# EAGLE design EBN_Storage_V01 (EAGLE 7.1.0)
CNAME: EasyBoard Nano; CREVISION: 1; DESIGNER: Martin Olejar
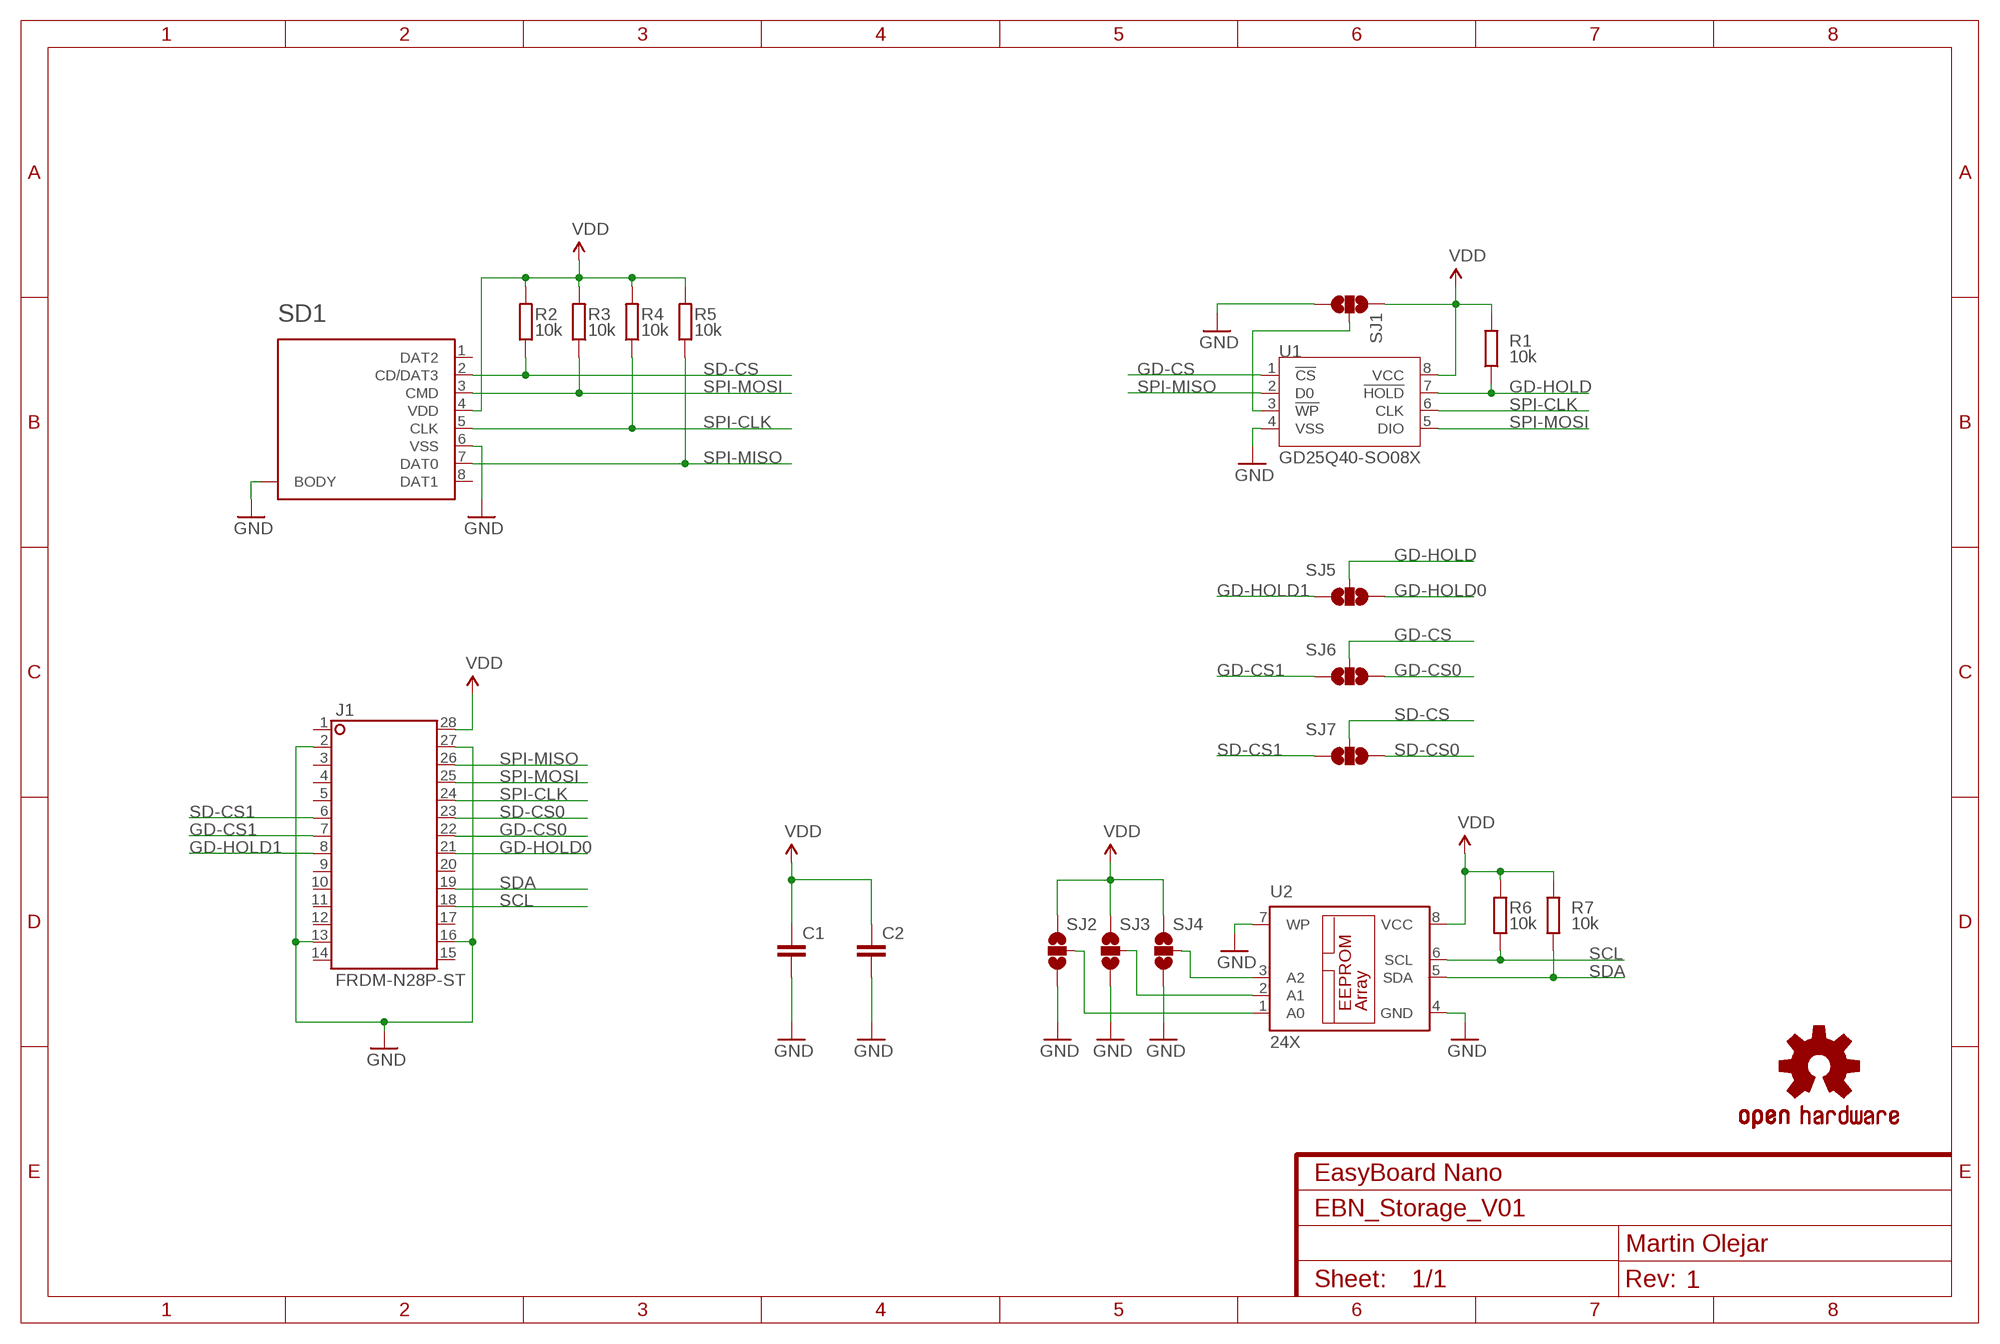
[diagram p0: schematic, sheet 1]

## Parts
C1  C-EUC0402  [C0402]
C2  C-EUC0603  [C0603]
J1  FRDM-N28P-ST  [FRDM-N28P-SHIELD]
LOGO1  OSHW-LOGOM  [OSHW-LOGO-M]
R1  10k  R-EUR0603  [R0603]
R2  10k  R-EUR0402  [R0402]
R3  10k  R-EUR0402  [R0402]
R4  10k  R-EUR0402  [R0402]
R5  10k  R-EUR0402  [R0402]
R6  10k  R-EUR0603  [R0603]
R7  10k  R-EUR0603  [R0603]
SD1  SDCARD  [MICRO-SD-01]
SJ1  SJ2W-S  [JUMPER-SMD-S2X]
SJ2  SJ2W-S  [JUMPER-SMD-S2X]
SJ3  SJ2W-S  [JUMPER-SMD-S2X]
SJ4  SJ2W-S  [JUMPER-SMD-S2X]
SJ5  SJ2W-S  [JUMPER-SMD-S2X]
SJ6  SJ2W-S  [JUMPER-SMD-S2X]
SJ7  SJ2W-S  [JUMPER-SMD-S2X]
U1  GD25Q40-SO08X  [SO08X@1]
U2  24X  [SO08X]

## Nets
GD-CS: SJ6.2 U1.1(!CS)
GD-CS0: J1.22 SJ6.1
GD-CS1: J1.7 SJ6.3
GD-HOLD: R1.1 SJ5.2 U1.7(!HOLD)
GD-HOLD0: J1.21 SJ5.1
GD-HOLD1: J1.8 SJ5.3
GND: C1.2 C2.2 J1.2 J1.13 J1.16 J1.27 SD1.6(VSS) SD1.SHELD@0(BODY) SD1.SHELD@1(BODY) SJ1.1 SJ2.1 SJ3.1 SJ4.1 U1.4(VSS) U2.4(GND) U2.7(WP)
N$1: SJ4.2 U2.3(A2)
N$2: SJ1.2 U1.3(!WP)
N$3: SJ3.2 U2.2(A1)
N$4: SJ2.2 U2.1(A0)
SCL: J1.18 R6.1 U2.6(SCL)
SD-CS: R2.1 SD1.2(CD/DAT3) SJ7.2
SD-CS0: J1.23 SJ7.1
SD-CS1: J1.6 SJ7.3
SDA: J1.19 R7.1 U2.5(SDA)
SPI-CLK: J1.24 R4.1 SD1.5(CLK) U1.6(CLK)
SPI-MISO: J1.26 R5.1 SD1.7(DAT0) U1.2(D0)
SPI-MOSI: J1.25 R3.1 SD1.3(CMD) U1.5(DIO)
VDD: C1.1 C2.1 J1.28 R1.2 R2.2 R3.2 R4.2 R5.2 R6.2 R7.2 SD1.4(VDD) SJ1.3 SJ2.3 SJ3.3 SJ4.3 U1.8(VCC) U2.8(VCC)
Unconnected: J1.1 J1.3 J1.4 J1.5 J1.9 J1.10 J1.11 J1.12 J1.14 J1.15 J1.17 J1.20 SD1.1(DAT2) SD1.8(DAT1)

## Library data of the parts
C1 C2 = atomx_RLC:C-EU: CAPACITOR, European symbol
J1 = atomx_Boards:FRDM-N28P: Dual In Line
LOGO1 = atomx_Common:OSHW-LOGO: Open Source Hardware Logo This logo indicates the piece of hardware it is found on incorporates a OSHW license and/or adheres to the definition of open source hardware found here: http://freedomdefined.org/OSHW
R1-R7 = atomx_RLC:R-EU: RESISTOR, European symbol
SD1 = atomx_Connectors:SDCARD
SJ1-SJ7 = atomx_Connectors:SJ2W: SMD solder JUMPER
U1 = atomx_IC:GD25Q40: SPI Flash 4Mbit (512kB)
U2 = atomx_IC:24*: Serial EEPROM I2C

## Board
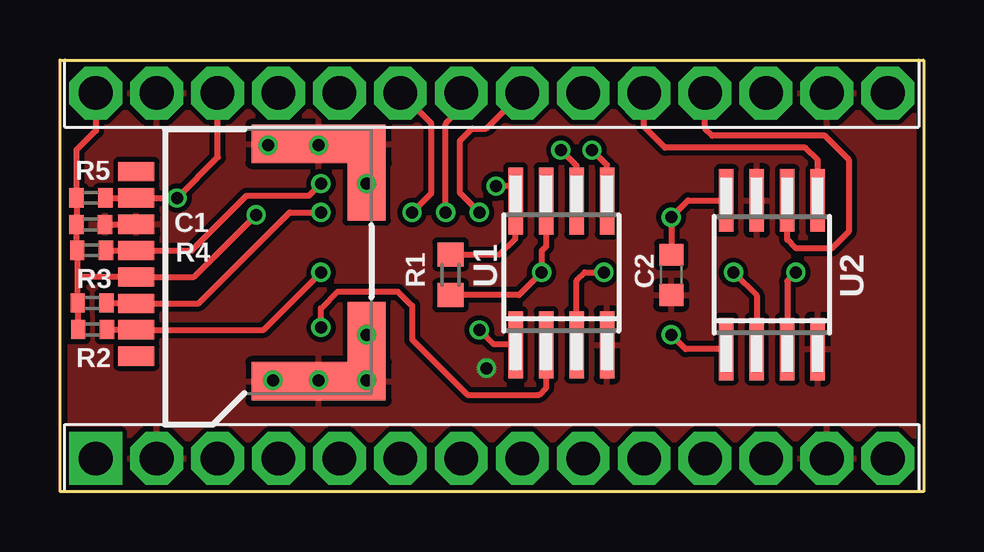
[diagram p1: board, top side]
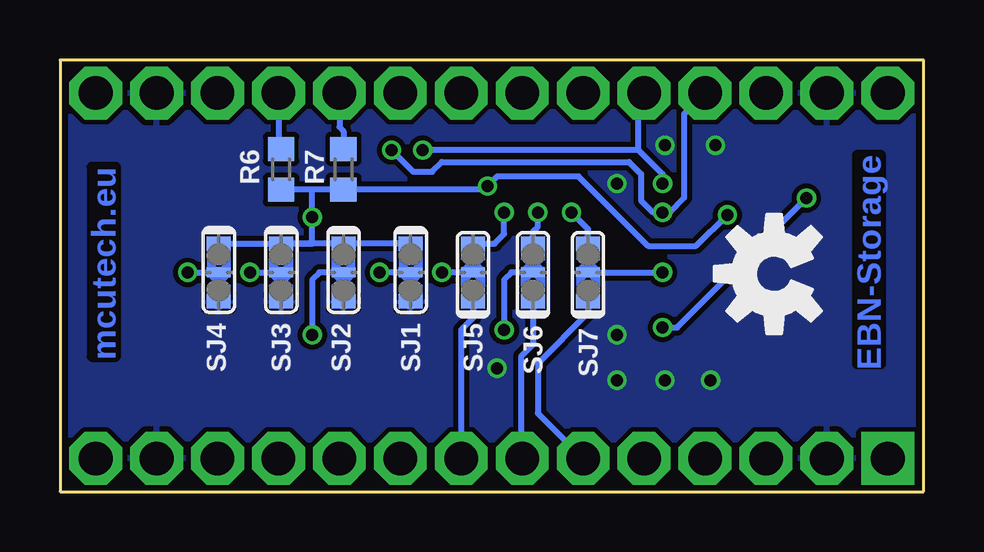
[diagram p2: board, bottom side, seen from below]

Size 36 x 18 mm. Coordinates in mm from the lower left corner, seen from the top.
Copper layers (1*16): Top 0.035mm / dielectric 1.5mm / Bottom 0.035mm
Design rules "ITEADstudio_DRC *": minimum track width 6mil, minimum drill 12mil, track to track 8mil, track to pad 8mil, pad to pad 8mil, via to via 8mil, smd to smd 0mil, copper to edge 10mil, drill to drill 10mil, minimum pad ring 10mil, minimum via ring 6mil, stop-mask expansion 2mil, vias tented up to drill 100mil, thermal gap 10mil

### Footprints (pad centres in the part's own frame; a part is rotated, then mirrored left to right if it is on the bottom)
C0402 = smd 0.6 x 0.8: 1 -0.6,0; 2 0.6,0
C0603 = smd 0.9 x 1: 1 -0.84,0; 2 0.84,0
FRDM-N28P-SHIELD = drill 1.4 pad 2.2 square: 1 -16.51,-7.62 | drill 1.4 pad 2.2 octagon: 2 -13.97,-7.62; 3 -11.43,-7.62; 4 -8.89,-7.62; 5 -6.35,-7.62; 6 -3.81,-7.62; 7 -1.27,-7.62; 8 1.27,-7.62; 9 3.81,-7.62; 10 6.35,-7.62; 11 8.89,-7.62; 12 11.43,-7.62; 13 13.97,-7.62; 14 16.51,-7.62; 15 16.51,7.62; 16 13.97,7.62; 17 11.43,7.62; 18 8.89,7.62; 19 6.35,7.62; 20 3.81,7.62; 21 1.27,7.62; 22 -1.27,7.62; 23 -3.81,7.62; 24 -6.35,7.62; 25 -8.89,7.62; 26 -11.43,7.62; 27 -13.97,7.62; 28 -16.51,7.62
R0603 = smd 1 x 1.1: 1 -0.85,0; 2 0.85,0
R0402 = smd 0.6 x 0.8: 1 -0.6,0; 2 0.6,0
MICRO-SD-01 = smd 0.8 x 1.5: 1 3.85,-5; 2 2.75,-5; 3 1.65,-5; 4 0.55,-5; 5 -0.55,-5; 6 -1.65,-5; 7 -2.75,-5; 8 -3.85,-5 | smd 1.6 x 5.6: SHELD@0 -5,2.6; SHELD@1 4.9,2.6 | smd 2.6 x 1.6: SHELD@2 -3.1,4.6; SHELD@3 2.9,4.6
JUMPER-SMD-S2X = smd 0.6 x 1: 1 -1.2,0; 3 1.2,0 | smd 0.4 x 1: 2 0,0
SO08X@1 = smd 0.6 x 2.8: 1 -1.905,-3; 2 -0.635,-3; 3 0.635,-3; 4 1.905,-3; 5 1.905,3; 6 0.635,3; 7 -0.635,3; 8 -1.905,3
SO08X = smd 0.6 x 2.6: 1 -1.905,-3.1; 2 -0.635,-3.1; 3 0.635,-3.1; 4 1.905,-3.1; 5 1.905,3.1; 6 0.635,3.1; 7 -0.635,3.1; 8 -1.905,3.1

### Placement (x,y rotation side)
C1  1.28,11.14 0 top
C2  25.48,9.04 270 top
J1  18,9 0 top
LOGO1  6.23,9.08 90 bottom
R1  16.28,9.04 90 top
R2  1.36,6.76 180 top
R3  1.34,7.86 180 top
R4  1.32,10.06 180 top
R5  1.29,12.25 180 top
R6  26.78,13.44 270 bottom
R7  24.18,13.44 270 bottom
SD1  8.18,9.5 270 top
SJ1  21.38,9.14 90 bottom
SJ2  24.18,9.14 90 bottom
SJ3  26.78,9.14 90 bottom
SJ4  29.38,9.14 90 bottom
SJ5  18.78,9.14 270 bottom
SJ6  16.28,9.14 270 bottom
SJ7  13.98,9.14 270 bottom
U1  20.9,9.12 0 top
U2  29.68,9.04 0 top

### Tracks (layer width: path | path; a pad name or v marks a point on that pad's centre or on a via)
GD-CS  (via drill 0.5)
  Top 0.254: U1.1 18.98,6.14 18.08,6.14 v17.48,6.74
  Bottom 0.254: SJ6.2 17.18,9.14 17.48,8.84 v17.48,6.74
GD-CS0  (via drill 0.5)
  Top 0.254: v16.08,11.64 16.08,15.34 16.73,15.99 J1.22
  Bottom 0.254: SJ6.1 16.28,10.84 16.08,11.04 v16.08,11.64
GD-CS1
  Bottom 0.254: SJ6.3 16.28,6.14 16.78,5.64 16.78,1.43 J1.7
GD-HOLD  (via drill 0.5)
  Top 0.254: U1.7 20.27,10.22 20.08,10.04 v20.08,9.14 19.13,8.19 R1.1
  Bottom 0.254: SJ5.2 v20.08,9.14
GD-HOLD0  (via drill 0.5)
  Top 0.254: v17.48,11.64 16.68,12.44 16.68,14.64 17.18,15.14 17.78,15.14 J1.21
  Bottom 0.254: SJ5.1 17.88,10.34 17.48,10.74 v17.48,11.64
GD-HOLD1
  Bottom 0.254: SJ5.3 18.78,7.24 19.28,6.74 J1.8
GND  (via drill 0.5)
  Top 0.254: C1.2 SD1.6
  other vias: 12.78,12.84 10.78,14.44 8.68,14.44 8.88,4.64 10.78,4.64 12.78,4.64 12.78,6.54 17.78,5.14
  pour Bottom: -0.02,18.04 35.98,18.04 35.98,0.04 -0.02,0.04
  pour Top: -0.02,18.04 35.98,18.04 35.98,0.04 -0.02,0.04
N$1  (via drill 0.5)
  Top 0.254: v30.68,9.14 30.32,8.77 U2.3
  Bottom 0.254: v30.68,9.14 SJ4.2
N$2  (via drill 0.5)
  Top 0.254: U1.3 21.54,8.79 21.88,9.14 v22.68,9.14
  Bottom 0.254: SJ1.2 v22.68,9.14
N$3  (via drill 0.5)
  Top 0.254: v28.08,9.14 29.05,8.17 U2.2
  Bottom 0.254: v28.08,9.14 SJ3.2
N$4  (via drill 0.5)
  Top 0.254: U2.1 26.08,5.94 v25.48,6.54
  Bottom 0.254: SJ2.2 25.18,9.14 25.48,8.84 v25.48,6.54
SCL
  Top 0.254: J1.18 26.89,15.14 27.19,14.84 31.88,14.84 32.88,13.84 32.88,10.84 32.18,10.14 30.68,10.14 30.32,10.5 U2.6
  Bottom 0.254: J1.18 26.89,14.3 R6.1
SD-CS  (via drill 0.5)
  Top 0.254: R2.1 SD1.2 8.49,6.75 v10.88,9.14
  Bottom 0.254: SJ7.2 v10.88,9.14
SD-CS0  (via drill 0.5)
  Top 0.254: v14.68,11.64 15.48,12.44 15.48,15.34 J1.23
  Bottom 0.254: SJ7.1 13.98,10.94 v14.68,11.64
SD-CS1
  Bottom 0.254: SJ7.3 13.98,7.44 16.08,5.34 16.08,3.27 J1.6
SDA
  Top 0.254: U2.5 31.59,13.83 31.08,14.34 25.22,14.34 24.35,15.21 J1.19
  Bottom 0.254: J1.19 24.35,15.21 24.18,15.04 R7.1
SPI-CLK  (via drill 0.5)
  Top 0.254: R4.1 SD1.5 5.49,10.05 7.78,12.34 10.38,12.34 v10.88,12.84 | U1.6 21.54,13.58 v20.88,14.24
  Bottom 0.254: v10.88,12.84 10.88,13.24 11.88,14.24 | 11.88,14.24 11.88,16.39 J1.24 | 11.88,14.24 v20.88,14.24
SPI-MISO  (via drill 0.5)  (1 unrouted)
  Top 0.254: R5.1 SD1.7 v4.89,12.25 6.58,13.94 J1.26 | v10.88,6.84 10.88,7.64 11.58,8.34 14.08,8.34 14.68,7.74 14.68,6.34 16.98,4.04 19.98,4.04 20.28,4.34 20.28,6.1 U1.2
  Bottom 0.254: v10.88,6.84 10.28,6.84 v4.88,12.24
SPI-MOSI  (via drill 0.5)
  Top 0.254: R3.1 SD1.3 5.79,7.85 9.58,11.64 v10.88,11.64 | U1.5 22.8,13.61 v22.18,14.24
  Bottom 0.254: v22.18,14.24 21.28,13.34 20.48,13.34 20.08,13.74 12.28,13.74 11.78,13.24 11.78,12.14 11.28,11.64 v10.88,11.64 10.58,11.64 9.98,12.24 9.98,15.75 J1.25
VDD  (via drill 0.5)
  Top 0.254: J1.28 1.49,15.05 0.68,14.24 R5.2 C1.1 0.68,10.1 R4.2 0.72,8.94 | 0.72,8.94 0.72,7.88 R3.2 0.76,7.84 R2.2 | 0.72,8.94 0.73,8.95 SD1.4 5.59,8.95 v8.18,11.54 | U2.8 26.18,12.14 v25.48,11.44 C2.1 | R1.2 18.33,9.89 18.98,10.54 18.98,12.1 U1.8 18.98,12.13 18.98,12.59 18.83,12.74 v18.18,12.74
  Bottom 0.254: 25.48,12.59 R7.2 18.33,12.59 v18.18,12.74 17.78,13.14 14.38,13.14 11.48,10.24 9.48,10.24 v8.18,11.54 | 25.48,12.59 R6.2 | 25.48,12.59 v25.48,11.44 25.48,10.34 SJ3.3 | SJ3.3 SJ2.3 SJ1.3 | SJ4.3 SJ3.3

### Text on the board
Bottom: EBN-Storage | mcutech.eu